# Altium schematic sheet OpticalFlowExt.SchDoc
size A4
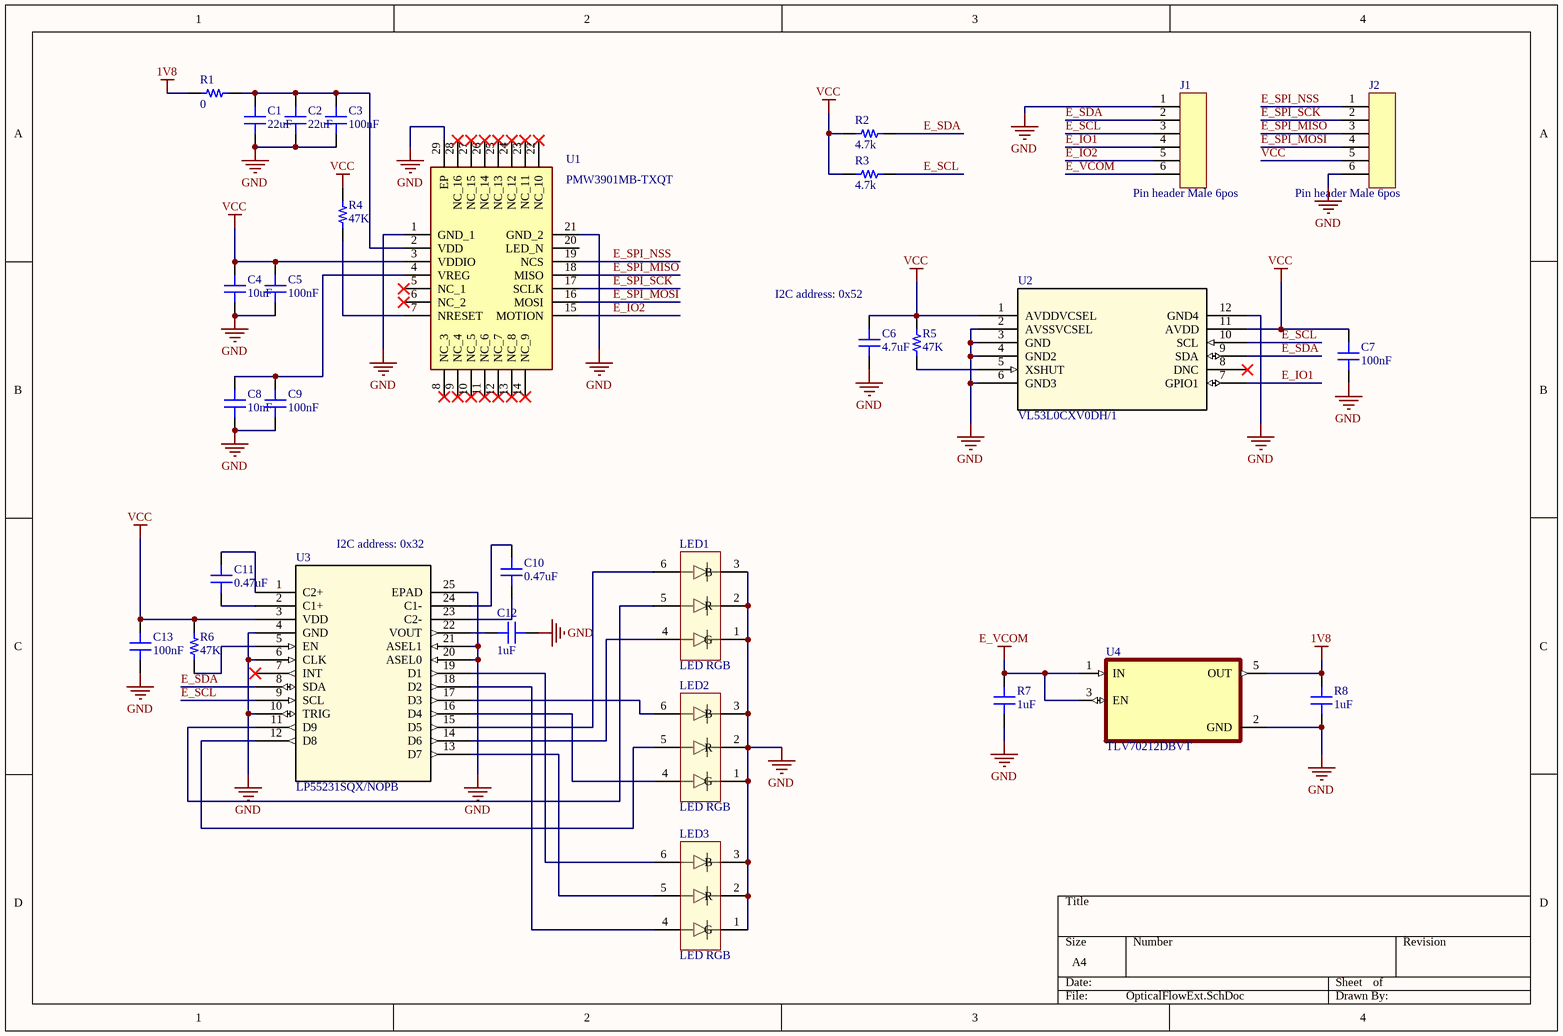
[diagram p0: OpticalFlowExt.SchDoc]

## Parts
C1  22uF  [CAP 0402_1005]
C2  22uF  [CAP 0402_1005]
C3  100nF  [CAP 0402_1005]
C4  10uF  [CAP 0402_1005]
C5  100nF  [CAP 0402_1005]
C6  4.7uF  [CAP 0402_1005]
C7  100nF  [CAP 0402_1005]
C8  10nF  [CAP 0402_1005]
C9  100nF  [CAP 0402_1005]
C10  0.47uF  [CAP 0402_1005]
C11  0.47uF  [CAP 0402_1005]
C12  1uF  [CAP 0402_1005]
C13  100nF  [CAP 0402_1005]
J1  Pin header Male 6pos  [6 pin pads]
J2  Pin header Male 6pos  [6 pin pads]
LED1  LED RGB  [PCBComponent_1]
LED2  LED RGB  [PCBComponent_1]
LED3  LED RGB  [PCBComponent_1]
R1  0  [RES 0402_1005]
R2  4.7k  [RES 0402_1005]
R3  4.7k  [RES 0402_1005]
R4  47K  [RES 0402_1005]
R5  47K  [RES 0402_1005]
R6  47K  [RES 0402_1005]
R7  1uF  [CAP 0402_1005]
R8  1uF  [CAP 0402_1005]
U1  PMW3901MB-TXQT  [PMW3901MBTXQT]
U2  VL53L0CXV0DH/1  [LGA12_STM]
U3  LP55231SQX/NOPB  [RTW24_TEX]
U4  TLV70212DBVT  [SOT95P280X145-5N]

## Nets
1V8: R1.1 R8.2 U4.5(OUT)
E_VCOM: J1.6 R7.2 U4.1(IN) U4.3(EN)
GND: C1.1 C2.1 C3.1 C4.1 C5.1 C6.1 C7.1 C8.1 C9.1 C12.1 C13.1 J1.1 J2.6 LED1.1(G) LED1.2(R) LED1.3(B) LED2.1(G) LED2.2(R) LED2.3(B) LED3.1(G) LED3.2(R) LED3.3(B) R7.1 R8.1 U1.1(GND_1) U1.21(GND_2) U1.29(EP) U2.2(AVSSVCSEL) U2.3(GND) U2.4(GND2) U2.6(GND3) U2.12(GND4) U3.4(GND) U3.6(CLK) U3.10(TRIG) U3.20(ASEL0) U3.21(ASEL1) U3.25(EPAD) U4.2(GND)
VCC: C4.2 C5.2 C6.2 C7.2 C13.2 J2.5 R2.2 R3.2 R4.2 R5.2 R6.2 U1.3(VDDIO) U2.1(AVDDVCSEL) U2.11(AVDD) U3.3(VDD)
E_IO1: J1.4 U2.7(GPIO1)
E_IO2: J1.5 U1.15(MOTION)
E_SCL: J1.3 R3.1 U2.10(SCL) U3.9(SCL)
E_SDA: J1.2 R2.1 U2.9(SDA) U3.8(SDA)
E_SPI_MISO: J2.3 U1.18(MISO)
E_SPI_MOSI: J2.4 U1.16(MOSI)
E_SPI_NSS: J2.1 U1.19(NCS)
E_SPI_SCK: J2.2 U1.17(SCLK)
NetC1_2: C1.2 C2.2 C3.2 R1.2 U1.2(VDD)
NetC8_2: C8.2 C9.2 U1.4(VREG)
NetC10_1: C10.1 U3.23(C2-)
NetC10_2: C10.2 U3.24(C1-)
NetC11_1: C11.1 U3.2(C1+)
NetC11_2: C11.2 U3.1(C2+)
NetC12_2: C12.2 U3.22(VOUT)
NetLED1_4: LED1.4 U3.14(D6)
NetLED1_5: LED1.5 U3.11(D9)
NetLED1_6: LED1.6 U3.15(D5)
NetLED2_4: LED2.4 U3.16(D4)
NetLED2_5: LED2.5 U3.12(D8)
NetLED2_6: LED2.6 U3.17(D3)
NetLED3_4: LED3.4 U3.18(D2)
NetLED3_5: LED3.5 U3.13(D7)
NetLED3_6: LED3.6 U3.19(D1)
NetR4_1: R4.1 U1.7(NRESET)
NetR5_1: R5.1 U2.5(XSHUT)
NetR6_1: R6.1 U3.5(EN)

Not connected (* = marked no-connect by the designer): U1 5(NC_1)* 6(NC_2)* 8(NC_3)* 9(NC_4)* 10(NC_5)* 11(NC_6)* 12(NC_7)* 13(NC_8)* 14(NC_9)* 20(LED_N) 22(NC_10)* 23(NC_11)* 24(NC_12)* 25(NC_13)* 26(NC_14)* 27(NC_15)* 28(NC_16)*; U2 8(DNC)*; U3 7(INT)*

## Notes on the sheet
- (near C6) I2C address: 0x52
- (near U3) I2C address: 0x32

## Library data of the parts
C1-C13 R7 R8 = C0402C151F5GAC7867: CAP CER 150PF 50V NP0 0402; Manufacturer: KEMET; Temperature Coefficient: C0G, NP0; Tolerance: ±1%; Part Number: C0402C151F5GAC7867; Applications: General Purpose; Capacitance: 150pF; ComponentLink1Description: Datasheet; ComponentLink1URL: https://api.kemet.com/component-edge/download/datasheet/C0402C151F5GAC7867.pdf; ComponentLink2Description: DigiKey Link; ComponentLink2URL: http://digikey.com/product-detail/en/kemet/C0402C151F5GAC7867/399-14269-1-ND/6827260; Device Package: 0402 (1005 Metric); Features: Low ESL; LastUpdated: 4/1/2020 11:57:05 PM; Lifecycle Status: Active; Minimum Order: 1; Mounting Type: Surface Mount, MLCC; Operating Temperature: -55°C ~ 125°C; Package / Case: 0402 (1005 Metric); Packaging: TapeAndReel; PartId: 1709; Part Status: Active; Price: 0.43; Series: SMD Comm C0G; Size / Dimension: 0.039" L x 0.020" W (1.00mm x 0.50mm); Supplier 1: DigiKey; Supplier Part Number 1: 399-14269-1-ND; Thickness (Max): 0.022" (0.55mm); Voltage - Rated: 50V
  C1 C2: Value: 22uF
  C3 C5 C7 C9 C13: Value: 100nF
  C4: Value: 10uF
  C6: Value: 4.7uF
  C8: Value: 10nF
  C10 C11: Value: 0.47uF
  C12 R7 R8: Value: 1uF
J1 J2 = Pin header Male 6pos: male pin header 6 pos
LED1-LED3 = LED RGB: 703-1039 element14
R1-R6 = RC0402FR-0747K5L: RES SMD 47.5K OHM 1% 1/16W 0402; Manufacturer: Yageo; Power (Watts): 0.063W, 1/16W; Resistance: 47.5 kOhms; Temperature Coefficient: ±100ppm/°C; Part Number: RC0402FR-0747K5L; ComponentLink1Description: Datasheet; ComponentLink1URL: https://www.yageo.com/upload/media/product/productsearch/datasheet/rchip/PYu-RC_Group_51_RoHS_L_10.pdf; ComponentLink2Description: DigiKey Link; ComponentLink2URL: http://digikey.com/product-detail/en/yageo/RC0402FR-0747K5L/311-47.5KLRCT-ND/729564; Composition: Thick Film; Device Package: 0402 (1005 Metric); Features: Moisture Resistant; Height - Seated (Max): 0.016" (0.40mm); LastUpdated: 1/21/2020 12:06:03 AM; Lifecycle Status: Active; Minimum Order: 1; Number of Terminations: 2; Operating Temperature: -55°C ~ 155°C; Package / Case: 0402 (1005 Metric); Packaging: CutTape; PartId: 2538; Part Status: Active; Price: 0.10; Series: RC; Size / Dimension: 0.039" L x 0.020" W (1.00mm x 0.50mm); Supplier 1: DigiKey; Supplier Part Number 1: 311-47.5KLRCT-ND; Supplier Device Package: 0402; Tolerance: ±1%
  R1: Value: 0
  R2 R3: Value: 4.7k
  R4-R6: Value: 47K
U1 = PMW3901MB-TXQT: Integrated Circuit; Manufacturer_Name: PixArt Imaging Inc.; Datasheet Link: http://www.pixart.com.tw/upload/POT0189-PMW3901MB-TXQT-DS-R1.10-200617%20(NonNDA)_20170720181537_20170802183402.pdf; Height: 2.36mm; Manufacturer_Part_Number: PMW3901MB-TXQT; Arrow Part Number: PMW3901MB-TXQT
U2 = VL53L0CXV0DH/1: No Description Available; Vendor: STMicroelectronics; Built_By: EMA_Jessica; SourceLibrary: STMicro_2020-01-02; Manufacturer_Part_Number: VL53L0CXV0DH/1; Copyright: Copyright (C) 2018 Accelerated Designs. All rights reserved; RefDes: RefDes; Type: DEV
U3 = LP55231SQX/NOPB: No Description Available; Vendor: Texas Instruments; Built_By: EMA_UL_Team; SourceLibrary: TI_2016-08-12; Manufacturer_Part_Number: LP55231SQX/NOPB; Copyright: Copyright (C) 2018 Accelerated Designs. All rights reserved; RefDes: RefDes; Type: DEV
U4 = LDO1.8: 300-mA, high-PSRR, low-IQ, low-dropout voltage regulator with enable 5-SOT-23 -40 to 125; MF: Texas Instruments; Availability: Unavailable; Value: *; Mouser-Purchase-URL: https://snapeda.com/shop?store=Mouser&id=799111; Texas_Instruments-Purchase-URL: https://snapeda.com/shop?store=Texas+Instruments&id=799111; Package: SOT-23-5 Texas Instruments; DigiKey-Purchase-URL: https://snapeda.com/shop?store=DigiKey&id=799111; Price: None; SnapEDA_Link: https://www.snapeda.com/parts/TLV70212DBVT/Texas%20Instruments/view-part/799111/?ref=snap; MP: TLV70212DBVT